# EAGLE design Input_v2_1 (EAGLE 9.6.2)
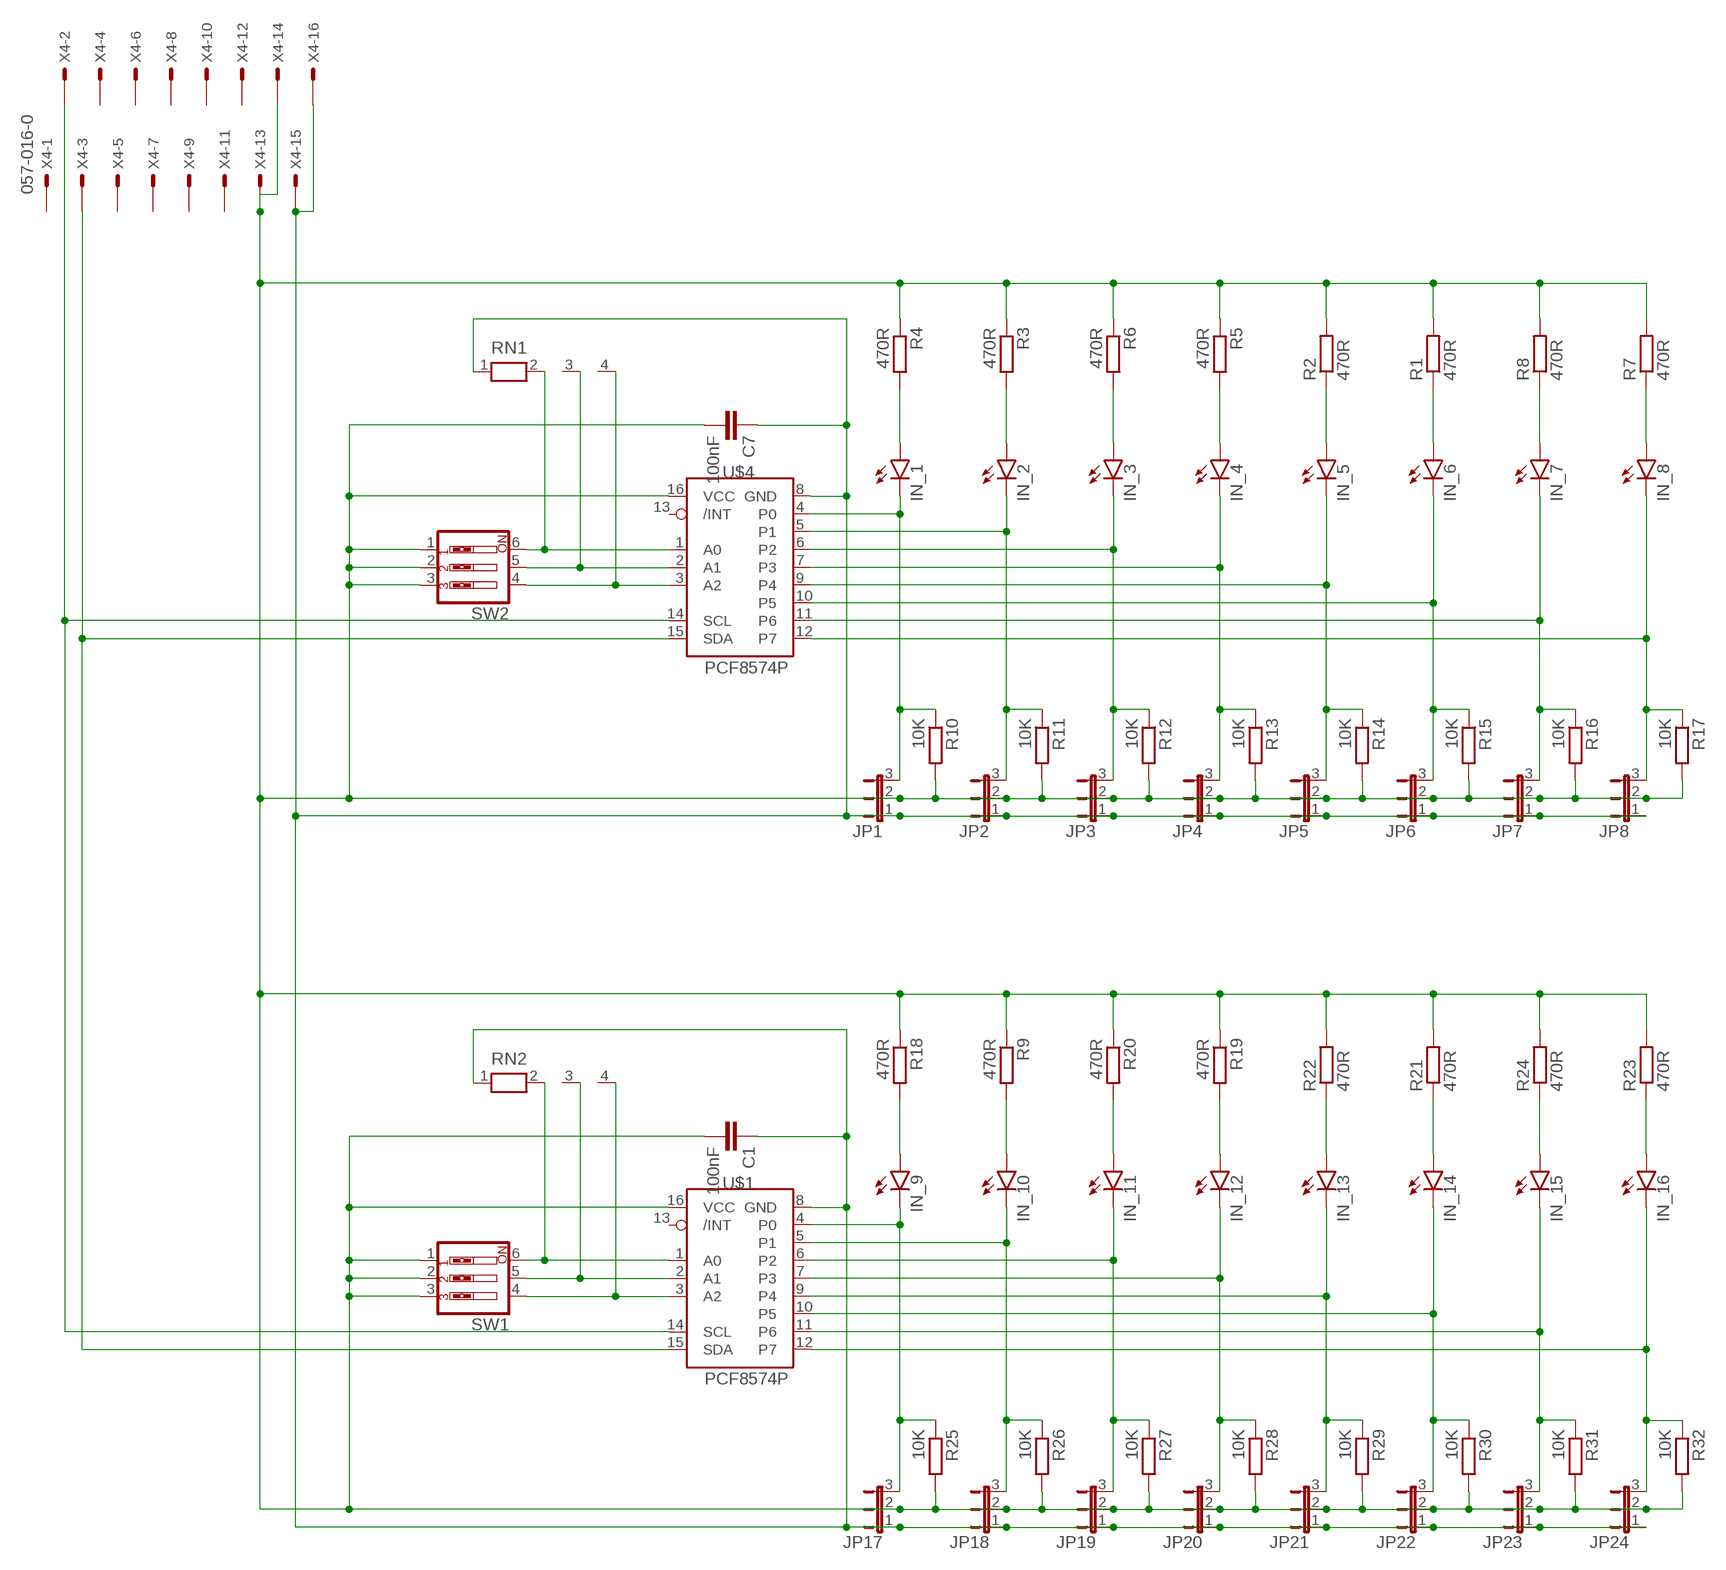
[diagram p0: schematic, sheet 1]

## Parts
C1  100nF  C-EU025-024X044  [C025-024X044]
C7  100nF  C-EU025-024X044  [C025-024X044]
IN_1  LED3MM  [LED3MM]
IN_2  LED3MM  [LED3MM]
IN_3  LED3MM  [LED3MM]
IN_4  LED3MM  [LED3MM]
IN_5  LED3MM  [LED3MM]
IN_6  LED3MM  [LED3MM]
IN_7  LED3MM  [LED3MM]
IN_8  LED3MM  [LED3MM]
IN_9  LED3MM  [LED3MM]
IN_10  LED3MM  [LED3MM]
IN_11  LED3MM  [LED3MM]
IN_12  LED3MM  [LED3MM]
IN_13  LED3MM  [LED3MM]
IN_14  LED3MM  [LED3MM]
IN_15  LED3MM  [LED3MM]
IN_16  LED3MM  [LED3MM]
JP1  JP2E  [JP2]
JP2  JP2E  [JP2]
JP3  JP2E  [JP2]
JP4  JP2E  [JP2]
JP5  JP2E  [JP2]
JP6  JP2E  [JP2]
JP7  JP2E  [JP2]
JP8  JP2E  [JP2]
JP17  JP2E  [JP2]
JP18  JP2E  [JP2]
JP19  JP2E  [JP2]
JP20  JP2E  [JP2]
JP21  JP2E  [JP2]
JP22  JP2E  [JP2]
JP23  JP2E  [JP2]
JP24  JP2E  [JP2]
R1  470R  R-EU_0309/10  [0309/10]
R2  470R  R-EU_0309/10  [0309/10]
R3  470R  R-EU_0309/10  [0309/10]
R4  470R  R-EU_0309/10  [0309/10]
R5  470R  R-EU_0309/10  [0309/10]
R6  470R  R-EU_0309/10  [0309/10]
R7  470R  R-EU_0309/10  [0309/10]
R8  470R  R-EU_0309/10  [0309/10]
R9  470R  R-EU_0309/10  [0309/10]
R10  10K  R-EU_0309/10  [0309/10]
R11  10K  R-EU_0309/10  [0309/10]
R12  10K  R-EU_0309/10  [0309/10]
R13  10K  R-EU_0309/10  [0309/10]
R14  10K  R-EU_0309/10  [0309/10]
R15  10K  R-EU_0309/10  [0309/10]
R16  10K  R-EU_0309/10  [0309/10]
R17  10K  R-EU_0309/10  [0309/10]
R18  470R  R-EU_0309/10  [0309/10]
R19  470R  R-EU_0309/10  [0309/10]
R20  470R  R-EU_0309/10  [0309/10]
R21  470R  R-EU_0309/10  [0309/10]
R22  470R  R-EU_0309/10  [0309/10]
R23  470R  R-EU_0309/10  [0309/10]
R24  470R  R-EU_0309/10  [0309/10]
R25  10K  R-EU_0309/10  [0309/10]
R26  10K  R-EU_0309/10  [0309/10]
R27  10K  R-EU_0309/10  [0309/10]
R28  10K  R-EU_0309/10  [0309/10]
R29  10K  R-EU_0309/10  [0309/10]
R30  10K  R-EU_0309/10  [0309/10]
R31  10K  R-EU_0309/10  [0309/10]
R32  10K  R-EU_0309/10  [0309/10]
RN1  RN03  [RN-3]
RN2  RN03  [RN-3]
SW1  SW_DIP-3  [EDG-03]
SW2  SW_DIP-3  [EDG-03]
U$1  PCF8574P  [DIL16]
U$4  PCF8574P  [DIL16]
X4  057-016-0  [057-016-0]

## Nets
GND2: C1.1 C7.1 JP1.1 JP2.1 JP3.1 JP4.1 JP5.1 JP6.1 JP7.1 JP8.1 JP17.1 JP18.1 JP19.1 JP20.1 JP21.1 JP22.1 JP23.1 JP24.1 RN1.1 RN2.1 U$1.8(GND) U$4.8(GND) X4.15 X4.16
N$1: IN_8.A R7.1
N$2: IN_7.A R8.1
N$3: IN_6.A R1.1
N$4: IN_5.A R2.1
N$5: IN_4.A R5.2
N$6: IN_3.A R6.2
N$7: IN_2.A R3.2
N$8: IN_1.A R4.2
N$9: RN2.4 SW1.4 U$1.3(A2)
N$10: RN2.3 SW1.5 U$1.2(A1)
N$11: RN2.2 SW1.6 U$1.1(A0)
N$12: RN1.2 SW2.6 U$4.1(A0)
N$13: RN1.3 SW2.5 U$4.2(A1)
N$14: RN1.4 SW2.4 U$4.3(A2)
N$18: IN_9.K(C) JP17.3 R25.1 U$1.4(P0)
N$19: IN_10.K(C) JP18.3 R26.1 U$1.5(P1)
N$20: IN_11.K(C) JP19.3 R27.1 U$1.6(P2)
N$21: IN_1.K(C) JP1.3 R10.1 U$4.4(P0)
N$22: IN_2.K(C) JP2.3 R11.1 U$4.5(P1)
N$23: IN_3.K(C) JP3.3 R12.1 U$4.6(P2)
N$24: IN_4.K(C) JP4.3 R13.1 U$4.7(P3)
N$25: IN_5.K(C) JP5.3 R14.1 U$4.9(P4)
N$26: IN_6.K(C) JP6.3 R15.1 U$4.10(P5)
N$27: IN_7.K(C) JP7.3 R16.1 U$4.11(P6)
N$28: IN_8.K(C) JP8.3 R17.1 U$4.12(P7)
N$29: IN_12.K(C) JP20.3 R28.1 U$1.7(P3)
N$30: IN_13.K(C) JP21.3 R29.1 U$1.9(P4)
N$31: IN_14.K(C) JP22.3 R30.1 U$1.10(P5)
N$32: IN_15.K(C) JP23.3 R31.1 U$1.11(P6)
N$33: IN_16.K(C) JP24.3 R32.1 U$1.12(P7)
N$34: IN_16.A R23.1
N$35: IN_15.A R24.1
N$36: IN_14.A R21.1
N$37: IN_13.A R22.1
N$38: IN_12.A R19.2
N$39: IN_11.A R20.2
N$40: IN_10.A R9.2
N$41: IN_9.A R18.2
N$42: U$1.15(SDA) U$4.15(SDA) X4.3
SCL: U$1.14(SCL) U$4.14(SCL) X4.2
VCC5.1: C1.2 C7.2 JP1.2 JP2.2 JP3.2 JP4.2 JP5.2 JP6.2 JP7.2 JP8.2 JP17.2 JP18.2 JP19.2 JP20.2 JP21.2 JP22.2 JP23.2 JP24.2 R1.2 R2.2 R3.1 R4.1 R5.1 R6.1 R7.2 R8.2 R9.1 R10.2 R11.2 R12.2 R13.2 R14.2 R15.2 R16.2 R17.2 R18.1 R19.1 R20.1 R21.2 R22.2 R23.2 R24.2 R25.2 R26.2 R27.2 R28.2 R29.2 R30.2 R31.2 R32.2 SW1.1 SW1.2 SW1.3 SW2.1 SW2.2 SW2.3 U$1.16(VCC) U$4.16(VCC) X4.13 X4.14
Unconnected: U$1.13(/INT) U$4.13(/INT) X4.1 X4.4 X4.5 X4.6 X4.7 X4.8 X4.9 X4.10 X4.11 X4.12

## Library data of the parts
C1 C7 = resistor:C-EU: CAPACITOR, European symbol
IN_1-IN_16 = led:LED: LED OSRAM: - CHIPLED LG R971, LG N971, LY N971, LG Q971, LY Q971, LO R971, LY R971 LH N974, LH R974 LS Q976, LO Q976, LY Q976 LO Q996 - Hyper CHIPLED LW Q18S LB Q993, LB Q99A, LB R99A - SideLED LS A670, LO A670, LY A670, LG A670, LP A670 LB A673, LV A673, LT A673, LW A673 LH A674 LY A675 LS A676, LA A676, LO A676, LY A676, LW A676 LS A679, LY A679, LG A679 - Hyper Micro SIDELED® LS Y876, LA Y876, LO Y876, LY Y876 LT Y87S - SmartLED LW L88C, LW L88S LB L89C, LB L89S, LG L890 LS L89K, LO L89K, LY L89K LS L896, LA L896, LO L896, LY L896 - TOPLED LS T670, LO T670, LY T670, LG T670, LP T670 LSG T670, LSP T670, LSY T670, LOP T670, LYG T670 LG T671, LOG T671, LSG T671 LB T673, LV T673, LT T673, LW T673 LH T674 LS T676, LA T676, LO T676, LY T676, LB T676, LH T676, LSB T676, LW T676 LB T67C, LV T67C, LT T67C, LS T67K, LO T67K, LY T67K, LW E67C LS E67B, LA E67B, LO E67B, LY E67B, LB E67C, LV E67C, LT E67C LW T67C LS T679, LY T679, LG T679 LS T770, LO T770, LY T770, LG T770, LP T770 LB T773, LV T773, LT T773, LW T773 LH T774 LS E675, LA E675, LY E675, LS T675 LS T776, LA T776, LO T776, LY T776, LB T776 LHGB T686 LT T68C, LB T68C - Hyper Mini TOPLED® LB M676 - Mini TOPLED Santana® LG M470 LS M47K, LO M47K, LY M47K Source: http://www.osram.convergy.de LUXEON: - LUMILED® LXK2-PW12-R00, LXK2-PW12-S00, LXK2-PW14-U00, LXK2-PW14-V00 LXK2-PM12-R00, LXK2-PM12-S00, LXK2-PM14-U00 LXK2-PE12-Q00, LXK2-PE12-R00, LXK2-PE12-S00, LXK2-PE14-T00, LXK2-PE14-U00 LXK2-PB12-K00, LXK2-PB12-L00, LXK2-PB12-M00, LXK2-PB14-N00, LXK2-PB14-P00, LXK2-PB14-Q00 LXK2-PR12-L00, LXK2-PR12-M00, LXK2-PR14-Q00, LXK2-PR14-R00 LXK2-PD12-Q00, LXK2-PD12-R00, LXK2-PD12-S00 LXK2-PH12-R00, LXK2-PH12-S00 LXK2-PL12-P00, LXK2-PL12-Q00, LXK2-PL12-R00 Source: www.luxeon.com KINGBRIGHT: KA-3528ASYC Source: www.kingbright.com
JP1-JP8 JP17-JP24 = jumper:JP2E: JUMPER
R1-R32 = resistor:R-EU_: RESISTOR, European symbol
RN1 RN2 = resistor-net_edit:RN03: RESISTOR NETWORK; OC_FARNELL: unknown; OC_NEWARK: unknown
SW1 SW2 = special:SW_DIP-3: DIP SWITCH
U$1 U$4 = i2c:PCF8574: Remote 8-Bit I/O Expander for I²C Bus
X4 = con-panduit:057-016-: CONNECTOR 10-pin series 057 contact pc board low profile headers; OC_FARNELL: unknown; OC_NEWARK: unknown

## Board
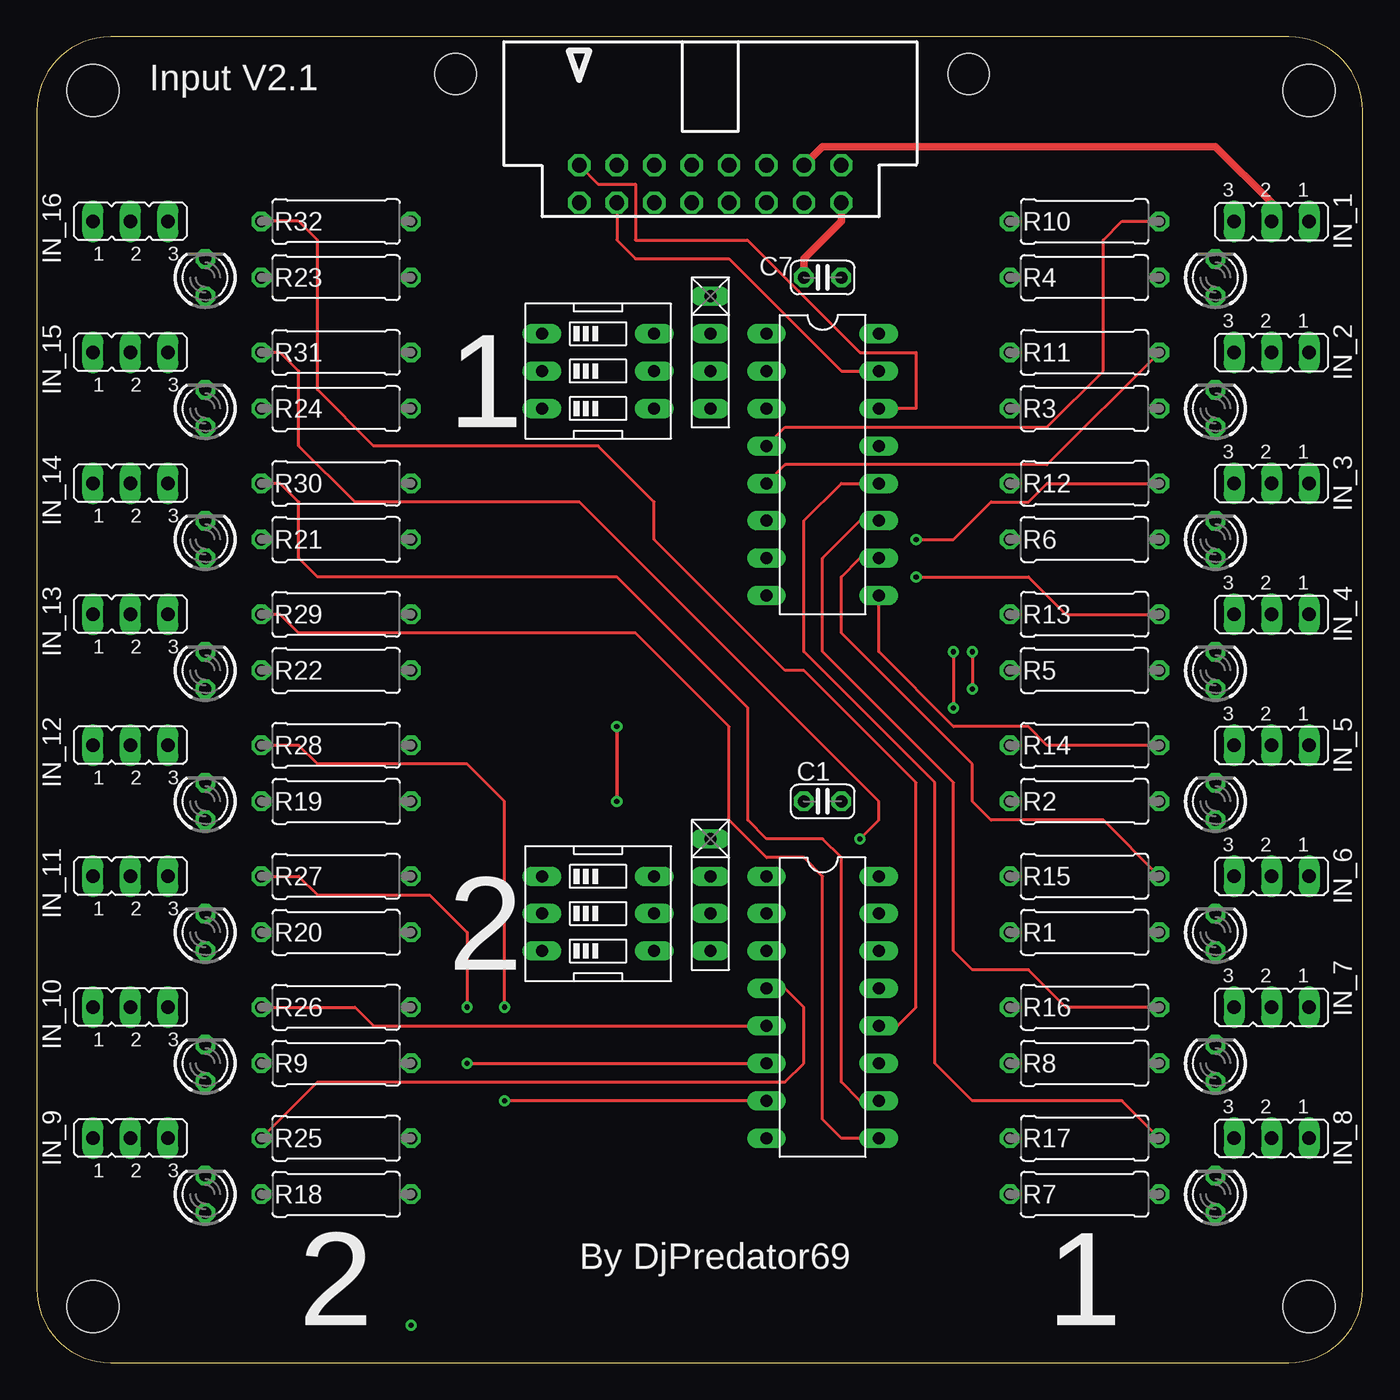
[diagram p1: board, top side]
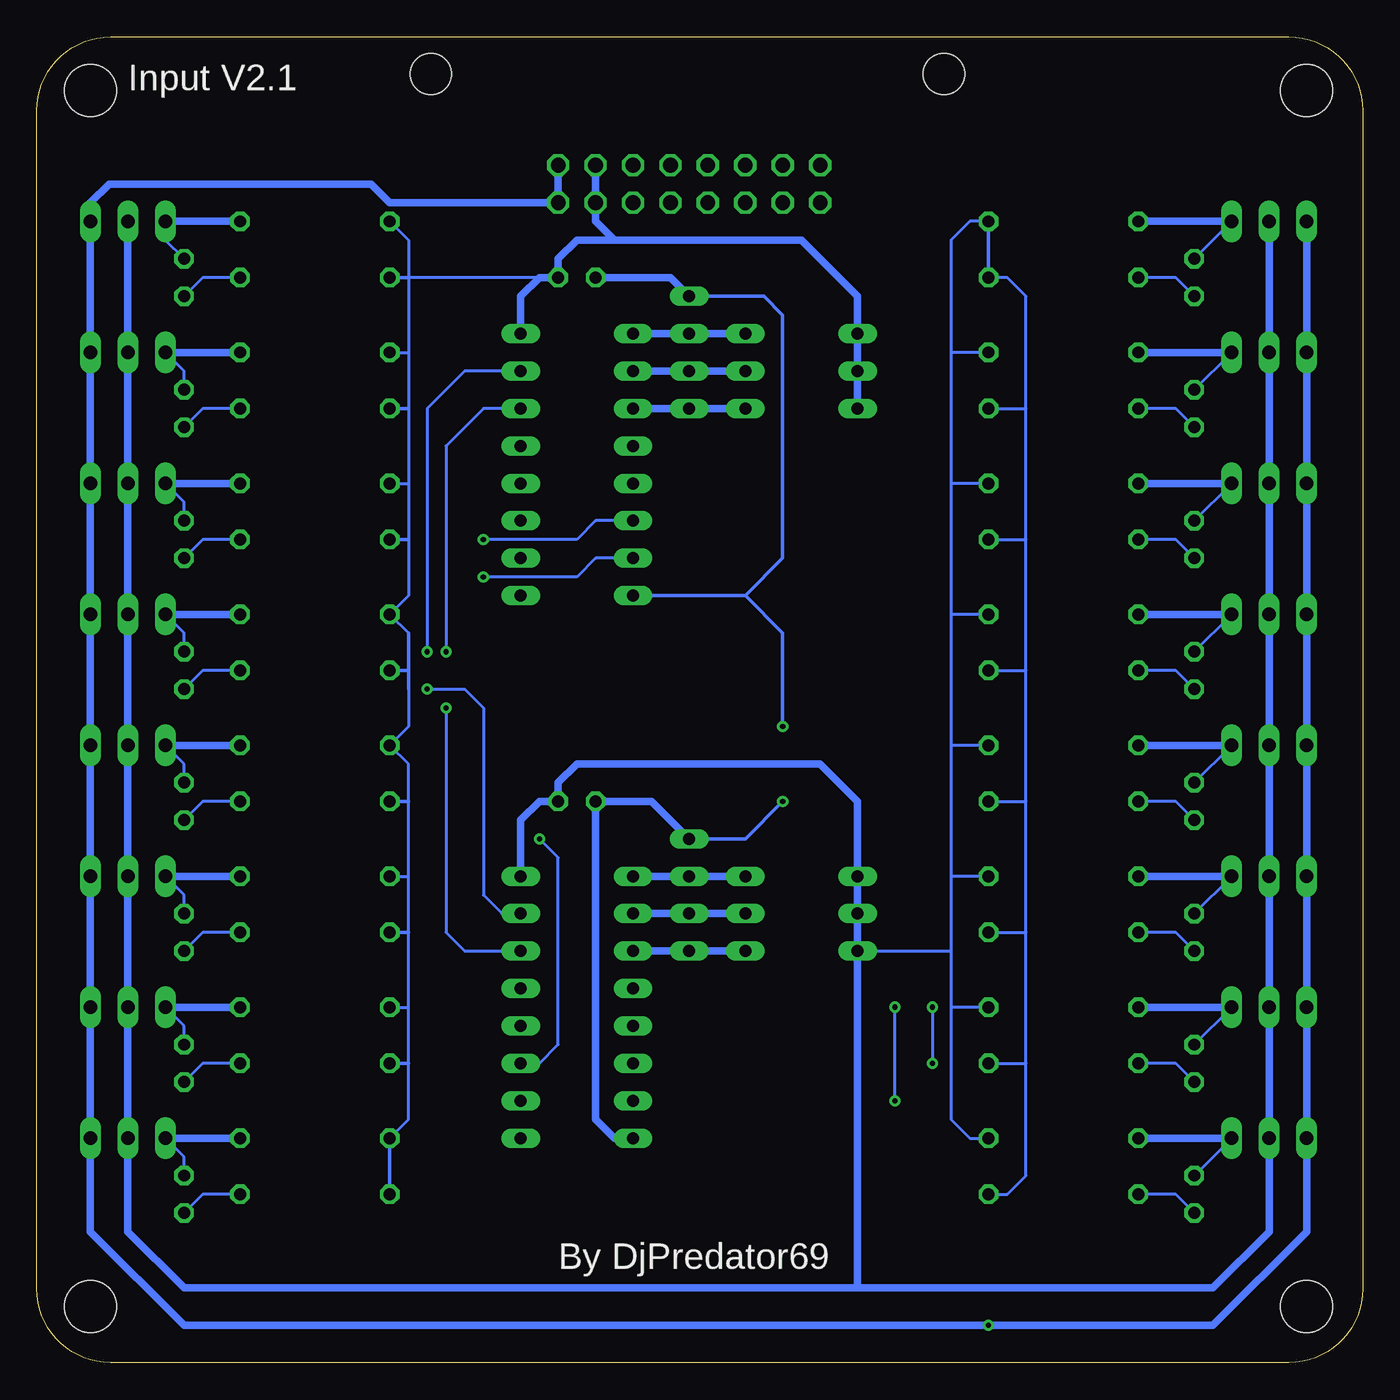
[diagram p2: board, bottom side, seen from below]

Size 90 x 90 mm. Coordinates in mm from the lower left corner, seen from the top.
Outline: 0,85 0,5 arc90 5,0 85,0 arc90 90,5 90,85 arc90 85,90 5,90 arc90 0,85
Copper layers (1*16): Top 0.035mm / dielectric 1.5mm / Bottom 0.035mm
Design rules "default": minimum track width 6mil, minimum drill 0.35mm, track to track 6mil, track to pad 6mil, pad to pad 6mil, via to via 6mil, smd to smd 6mil, copper to edge 40mil, drill to drill 6mil, minimum pad ring 10mil, minimum via ring 8mil, stop-mask expansion 4mil, vias tented up to drill 0mil, thermal gap 10mil
Holes 3.5 mm at 86.36,86.36 3.81,86.36 3.81,3.81 86.36,3.81

### Footprints (pad centres in the part's own frame; a part is rotated, then mirrored left to right if it is on the bottom)
C025-024X044 = drill 0.813 octagon: 1 -1.27,0; 2 1.27,0
LED3MM = drill 0.813 octagon: A -1.27,0; K 1.27,0
JP2 = drill 0.914 long: 1 -2.54,0; 2 0,0; 3 2.54,0
0309/10 = drill 0.813 octagon: 1 -5.08,0; 2 5.08,0
RN-3 = drill 0.813 long: 1 -5.08,0; 2 -2.54,0; 3 0,0; 4 2.54,0
EDG-03 = drill 0.813 long: 1 -2.54,-3.81; 2 0,-3.81; 3 2.54,-3.81; 4 2.54,3.81; 5 0,3.81; 6 -2.54,3.81
DIL16 = drill 0.813 long: 1 -8.89,-3.81; 2 -6.35,-3.81; 3 -3.81,-3.81; 4 -1.27,-3.81; 5 1.27,-3.81; 6 3.81,-3.81; 7 6.35,-3.81; 8 8.89,-3.81; 9 8.89,3.81; 10 6.35,3.81; 11 3.81,3.81; 12 1.27,3.81; 13 -1.27,3.81; 14 -3.81,3.81; 15 -6.35,3.81; 16 -8.89,3.81
057-016-0 = drill 1 octagon: 1 -8.89,-5.08; 2 -8.89,-2.54; 3 -6.35,-5.08; 4 -6.35,-2.54; 5 -3.81,-5.08; 6 -3.81,-2.54; 7 -1.27,-5.08; 8 -1.27,-2.54; 9 1.27,-5.08; 10 1.27,-2.54; 11 3.81,-5.08; 12 3.81,-2.54; 13 6.35,-5.08; 14 6.35,-2.54; 15 8.89,-5.08; 16 8.89,-2.54 | hole 2.8: -17.29,3.66; 17.54,3.66

### Placement (x,y rotation side)
C1  53.34,38.1 0 top
C7  53.34,73.66 0 top
IN_1  80.01,73.66 90 top
IN_2  80.01,64.77 90 top
IN_3  80.01,55.88 90 top
IN_4  80.01,46.99 90 top
IN_5  80.01,38.1 90 top
IN_6  80.01,29.21 90 top
IN_7  80.01,20.32 90 top
IN_8  80.01,11.43 90 top
IN_9  11.43,11.43 90 top
IN_10  11.43,20.32 90 top
IN_11  11.43,29.21 90 top
IN_12  11.43,38.1 90 top
IN_13  11.43,46.99 90 top
IN_14  11.43,55.88 90 top
IN_15  11.43,64.77 90 top
IN_16  11.43,73.66 90 top
JP1  83.82,77.47 180 top
JP2  83.82,68.58 180 top
JP3  83.82,59.69 180 top
JP4  83.82,50.8 180 top
JP5  83.82,41.91 180 top
JP6  83.82,33.02 180 top
JP7  83.82,24.13 180 top
JP8  83.82,15.24 180 top
JP17  6.35,15.24 0 top
JP18  6.35,24.13 0 top
JP19  6.35,33.02 0 top
JP20  6.35,41.91 0 top
JP21  6.35,50.8 0 top
JP22  6.35,59.69 0 top
JP23  6.35,68.58 0 top
JP24  6.35,77.47 0 top
R1  71.12,29.21 180 top
R2  71.12,38.1 180 top
R3  71.12,64.77 0 top
R4  71.12,73.66 0 top
R5  71.12,46.99 0 top
R6  71.12,55.88 0 top
R7  71.12,11.43 180 top
R8  71.12,20.32 180 top
R9  20.32,20.32 180 top
R10  71.12,77.47 180 top
R11  71.12,68.58 180 top
R12  71.12,59.69 180 top
R13  71.12,50.8 180 top
R14  71.12,41.91 180 top
R15  71.12,33.02 180 top
R16  71.12,24.13 180 top
R17  71.12,15.24 180 top
R18  20.32,11.43 180 top
R19  20.32,38.1 180 top
R20  20.32,29.21 180 top
R21  20.32,55.88 0 top
R22  20.32,46.99 0 top
R23  20.32,73.66 0 top
R24  20.32,64.77 0 top
R25  20.32,15.24 0 top
R26  20.32,24.13 0 top
R27  20.32,33.02 0 top
R28  20.32,41.91 0 top
R29  20.32,50.8 0 top
R30  20.32,59.69 0 top
R31  20.32,68.58 0 top
R32  20.32,77.47 0 top
RN1  45.72,67.31 270 top
RN2  45.72,30.48 270 top
SW1  38.1,30.48 270 top
SW2  38.1,67.31 270 top
U$1  53.34,24.13 270 top
U$4  53.34,60.96 270 top
X4  45.72,83.82 0 top

### Tracks (layer width: path | path; a pad name or v marks a point on that pad's centre or on a via)
GND2  (via drill 0.35)
  Top 0.254: v39.37,43.18 v39.37,38.1
  Top 0.508: C7.1 52.07,74.93 54.61,77.47 X4.15
  Bottom 0.254: RN1.1 40.64,72.39 39.37,71.12 39.37,54.61 41.91,52.07 | U$4.8 41.91,52.07 | 41.91,52.07 39.37,49.53 v39.37,43.18 | v39.37,38.1 41.91,35.56 RN2.1
  Bottom 0.508: JP24.1 JP23.1 JP22.1 JP21.1 JP20.1 JP19.1 JP18.1 JP17.1 3.81,8.89 10.16,2.54 v25.4,2.54 80.01,2.54 86.36,8.89 JP8.1 JP7.1 JP6.1 JP5.1 JP4.1 JP3.1 JP2.1 JP1.1 86.36,78.74 85.09,80.01 67.31,80.01 66.04,78.74 X4.15 X4.16 | RN1.1 46.99,73.66 C7.1 | RN2.1 48.26,38.1 C1.1 52.07,16.51 50.8,15.24 U$1.8
N$1
  Bottom 0.2: R7.1 78.74,11.43 IN_8.A
N$2
  Bottom 0.2: R8.1 78.74,20.32 IN_7.A
N$3
  Bottom 0.2: R1.1 78.74,29.21 IN_6.A
N$4
  Bottom 0.2: R2.1 78.74,38.1 IN_5.A
N$5
  Bottom 0.2: R5.2 78.74,46.99 IN_4.A
N$6
  Bottom 0.2: R6.2 78.74,55.88 IN_3.A
N$7
  Bottom 0.2: R3.2 78.74,64.77 IN_2.A
N$8
  Bottom 0.2: R4.2 78.74,73.66 IN_1.A
N$9
  Bottom 0.508: SW1.4 RN2.4 U$1.3
N$10
  Bottom 0.508: SW1.5 RN2.3 U$1.2
N$11
  Bottom 0.508: SW1.6 RN2.2 U$1.1
N$12
  Bottom 0.508: SW2.6 RN1.2 U$4.1
N$13
  Bottom 0.508: U$4.2 RN1.3 SW2.5
N$14
  Bottom 0.508: SW2.4 RN1.4 U$4.3
N$18
  Top 0.2: R25.1 19.05,19.05 50.8,19.05 52.07,20.32 52.07,24.13 50.8,25.4 U$1.4
  Bottom 0.2: IN_9.K JP17.3
  Bottom 0.508: JP17.3 R25.1
N$19
  Top 0.2: R26.1 21.59,24.13 22.86,22.86 U$1.5
  Bottom 0.2: IN_10.K JP18.3
  Bottom 0.508: JP18.3 R26.1
N$20  (via drill 0.35)
  Top 0.2: R27.1 17.78,33.02 19.05,31.75 26.67,31.75 29.21,29.21 v29.21,24.13 | v29.21,20.32 U$1.6
  Bottom 0.2: v29.21,24.13 v29.21,20.32 | IN_11.K JP19.3
  Bottom 0.508: JP19.3 R27.1
N$21
  Top 0.2: U$4.4 50.8,63.5 68.58,63.5 72.39,67.31 72.39,76.2 73.66,77.47 R10.1
  Bottom 0.2: IN_1.K 81.28,76.2 JP1.3
  Bottom 0.508: R10.1 JP1.3
N$22
  Top 0.2: R11.1 68.58,60.96 50.8,60.96 U$4.5
  Bottom 0.2: IN_2.K 80.01,67.31 JP2.3
  Bottom 0.508: R11.1 JP2.3
N$23  (via drill 0.35)
  Top 0.2: v59.69,55.88 62.23,55.88 64.77,58.42 67.31,58.42 68.58,59.69 R12.1
  Bottom 0.2: U$4.6 52.07,57.15 53.34,55.88 v59.69,55.88 | IN_3.K 80.01,58.42 JP3.3
  Bottom 0.508: R12.1 JP3.3
N$24  (via drill 0.35)
  Top 0.2: v59.69,53.34 67.31,53.34 69.85,50.8 R13.1
  Bottom 0.2: U$4.7 52.07,54.61 53.34,53.34 v59.69,53.34 | IN_4.K 80.01,49.53 JP4.3
  Bottom 0.508: R13.1 JP4.3
N$25
  Top 0.2: R14.1 68.58,41.91 67.31,43.18 62.23,43.18 57.15,48.26 U$4.9
  Bottom 0.2: IN_5.K 80.01,40.64 JP5.3
  Bottom 0.508: R14.1 JP5.3
N$26
  Top 0.2: R15.1 72.39,36.83 64.77,36.83 63.5,38.1 63.5,40.64 54.61,49.53 54.61,53.34 55.88,54.61 U$4.10
  Bottom 0.2: IN_6.K 80.01,31.75 JP6.3
  Bottom 0.508: R15.1 JP6.3
N$27
  Top 0.2: R16.1 69.85,24.13 67.31,26.67 63.5,26.67 62.23,27.94 62.23,39.37 53.34,48.26 53.34,54.61 55.88,57.15 U$4.11
  Bottom 0.2: IN_7.K 80.01,22.86 JP7.3
  Bottom 0.508: R16.1 JP7.3
N$28
  Top 0.2: R17.1 73.66,17.78 63.5,17.78 60.96,20.32 60.96,39.37 52.07,48.26 52.07,57.15 54.61,59.69 U$4.12
  Bottom 0.2: IN_8.K 80.01,13.97 JP8.3
  Bottom 0.508: R17.1 JP8.3
N$29  (via drill 0.35)
  Top 0.2: U$1.7 v31.75,17.78 | v31.75,24.13 31.75,38.1 29.21,40.64 19.05,40.64 17.78,41.91 R28.1
  Bottom 0.2: v31.75,17.78 v31.75,24.13 | IN_12.K JP20.3
  Bottom 0.508: JP20.3 R28.1
N$30
  Top 0.2: U$1.9 54.61,15.24 53.34,16.51 53.34,33.02 52.07,34.29 49.53,34.29 46.99,36.83 46.99,43.18 40.64,49.53 17.78,49.53 16.51,50.8 R29.1
  Bottom 0.2: IN_13.K JP21.3
  Bottom 0.508: JP21.3 R29.1
N$31
  Top 0.2: U$1.10 55.88,17.78 54.61,19.05 54.61,34.29 53.34,35.56 49.53,35.56 48.26,36.83 48.26,44.45 39.37,53.34 19.05,53.34 17.78,54.61 17.78,58.42 16.51,59.69 R30.1
  Bottom 0.2: IN_14.K JP22.3
  Bottom 0.508: JP22.3 R30.1
N$32  (via drill 0.35)
  Top 0.2: v55.88,35.56 57.15,36.83 57.15,38.1 36.83,58.42 21.59,58.42 17.78,62.23 17.78,67.31 16.51,68.58 R31.1
  Bottom 0.2: U$1.11 55.88,20.32 54.61,21.59 54.61,34.29 v55.88,35.56 | IN_15.K JP23.3
  Bottom 0.508: JP23.3 R31.1
N$33
  Top 0.2: U$1.12 58.42,22.86 59.69,24.13 59.69,39.37 52.07,46.99 50.8,46.99 41.91,55.88 41.91,58.42 38.1,62.23 22.86,62.23 19.05,66.04 19.05,76.2 17.78,77.47 R32.1
  Bottom 0.2: IN_16.K JP24.3
  Bottom 0.508: JP24.3 R32.1
N$34
  Bottom 0.2: IN_16.A 12.7,73.66 R23.1
N$35
  Bottom 0.2: IN_15.A 12.7,64.77 R24.1
N$36
  Bottom 0.2: IN_14.A 12.7,55.88 R21.1
N$37
  Bottom 0.2: IN_13.A 12.7,46.99 R22.1
N$38
  Bottom 0.2: IN_12.A 12.7,38.1 R19.2
N$39
  Bottom 0.2: IN_11.A 12.7,29.21 R20.2
N$40
  Bottom 0.2: IN_10.A 12.7,20.32 R9.2
N$41
  Bottom 0.2: IN_9.A 12.7,11.43 R18.2
N$42  (via drill 0.35)
  Top 0.2: X4.3 39.37,76.2 40.64,74.93 46.99,74.93 54.61,67.31 U$4.15 | v63.5,48.26 v63.5,45.72
  Bottom 0.2: U$4.15 60.96,67.31 63.5,64.77 v63.5,48.26 | v63.5,45.72 60.96,45.72 59.69,44.45 59.69,31.75 58.42,30.48 U$1.15
SCL  (via drill 0.35)
  Top 0.2: X4.2 38.1,80.01 40.64,80.01 40.64,76.2 48.24,76.2 51.69,72.75 51.71,72.75 55.88,68.58 59.69,68.58 59.69,64.77 U$4.14 | v62.23,48.26 v62.23,44.45
  Bottom 0.2: U$4.14 59.69,64.77 62.23,62.23 v62.23,48.26 | v62.23,44.45 62.23,29.21 60.96,27.94 U$1.14
VCC5.1
  Top 0.508: JP1.2 83.82,78.74 80.01,82.55 53.34,82.55 X4.14
  Bottom 0.2: R32.2 26.67,77.47 27.94,76.2 27.94,68.58 | 27.94,68.58 27.94,59.69 | 27.94,59.69 27.94,50.8 | 27.94,50.8 27.94,41.91 | 27.94,41.91 27.94,33.02 | 27.94,33.02 27.94,27.94 | 27.94,27.94 27.94,24.13 | 27.94,24.13 27.94,16.51 26.67,15.24 R25.2 | R26.2 27.94,24.13 | SW1.3 27.94,27.94 | R27.2 27.94,33.02 | R28.2 27.94,41.91 | R29.2 27.94,50.8 | R30.2 27.94,59.69 | R31.2 27.94,68.58 | R10.2 64.77,76.2 64.77,73.66 | 64.77,73.66 64.77,68.58 | 64.77,68.58 64.77,64.77 64.77,59.69 | 64.77,59.69 64.77,55.88 64.77,52.07 R13.2 64.77,49.53 | R12.2 64.77,59.69 | R11.2 64.77,68.58 | C7.2 64.77,73.66 | R17.2 64.77,16.51 64.77,20.32 64.77,24.13 | 64.77,24.13 64.77,29.21 64.77,33.02 | 64.77,33.02 64.77,38.1 64.77,40.64 R14.2 64.77,43.18 64.77,45.72 | R15.2 64.77,33.02 | R16.2 64.77,24.13 | R18.1 24.13,11.43 22.86,12.7 22.86,20.32 | 22.86,20.32 22.86,29.21 | 22.86,29.21 22.86,38.1 | 22.86,38.1 22.86,46.99 | 22.86,46.99 22.86,55.88 | 22.86,55.88 22.86,64.77 | 22.86,64.77 22.86,72.39 24.13,73.66 R23.2 | R9.1 22.86,20.32 | R20.1 22.86,29.21 | R19.1 22.86,38.1 | R22.2 22.86,46.99 | R21.2 22.86,55.88 | R24.2 22.86,64.77
  Bottom 0.254: R4.1 64.77,73.66 | R3.1 64.77,64.77 | R6.1 64.77,55.88 | 64.77,49.53 64.77,46.99 | 64.77,46.99 64.77,45.72 | R5.1 64.77,46.99 | R2.2 64.77,38.1 | R1.2 64.77,29.21 | R8.2 64.77,20.32 | R7.2 R17.2 | R23.2 R32.2
  Bottom 0.508: JP24.2 JP23.2 JP22.2 JP21.2 JP20.2 JP19.2 JP18.2 JP17.2 6.35,8.89 10.16,5.08 34.29,5.08 | JP1.2 JP2.2 JP3.2 JP4.2 JP5.2 JP6.2 JP7.2 JP8.2 83.82,8.89 80.01,5.08 34.29,5.08 | X4.14 X4.13 52.07,77.47 50.8,76.2 | SW2.3 SW2.2 SW2.1 34.29,72.39 38.1,76.2 50.8,76.2 | U$1.16 57.15,36.83 55.88,38.1 C1.2 54.61,39.37 53.34,40.64 36.83,40.64 34.29,38.1 SW1.1 SW1.2 SW1.3 34.29,5.08 | U$4.16 57.15,72.39 55.88,73.66 C7.2 54.61,74.93 53.34,76.2 50.8,76.2

### Text on the board
tNames: Input V2.1 | 1 | 2 | By DjPredator69 | 2 | 1
bNames: Input V2.1 | By DjPredator69